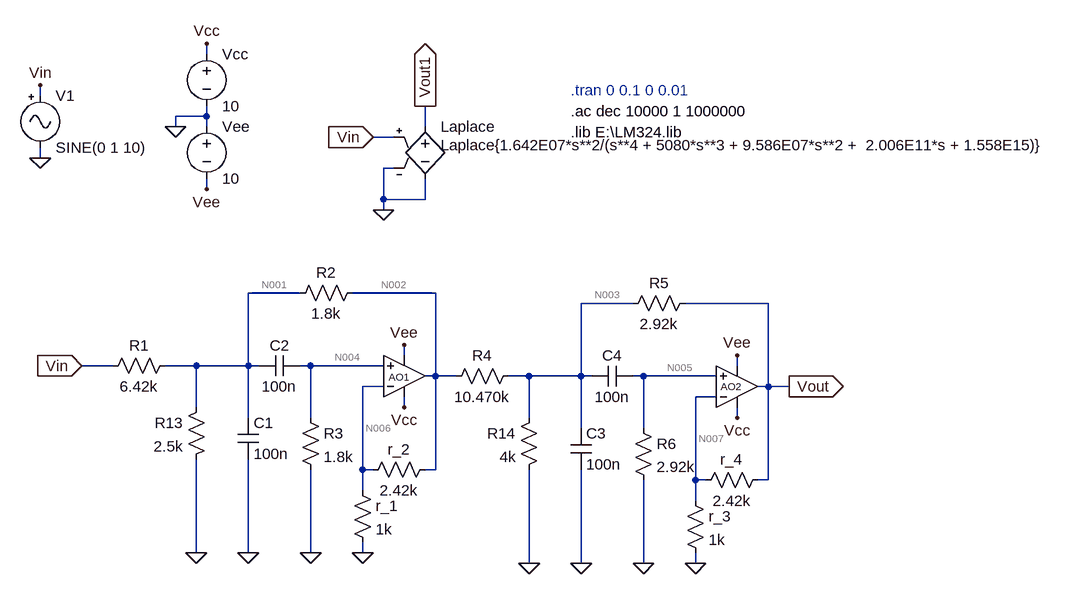
[diagram p0: schematic Filtro_Ajuste_Ganancia_2.asc]
Filtro_Ajuste_Ganancia_2.asc, the LTspice schematic file:
Version 4.1
SHEET 1 1376 980
WIRE -64 -416 -64 -432
WIRE -320 -352 -320 -368
WIRE -64 -320 -64 -336
WIRE -64 -320 -112 -320
WIRE -112 -304 -112 -320
WIRE -64 -304 -64 -320
WIRE 272 -304 272 -336
WIRE 224 -288 192 -288
WIRE -320 -256 -320 -272
WIRE 224 -240 208 -240
WIRE -64 -208 -64 -224
WIRE 208 -192 208 -240
WIRE 272 -192 272 -224
WIRE 272 -192 208 -192
WIRE 208 -176 208 -192
WIRE 80 -48 0 -48
WIRE 288 -48 160 -48
WIRE 592 -32 512 -32
WIRE 800 -32 672 -32
WIRE 240 48 240 32
WIRE -208 64 -256 64
WIRE -80 64 -128 64
WIRE 0 64 0 -48
WIRE 0 64 -80 64
WIRE 16 64 0 64
WIRE 96 64 80 64
WIRE 208 64 96 64
WIRE 752 64 752 48
WIRE 288 80 288 -48
WIRE 288 80 272 80
WIRE 320 80 288 80
WIRE 432 80 400 80
WIRE 512 80 512 -32
WIRE 512 80 432 80
WIRE 528 80 512 80
WIRE 608 80 592 80
WIRE 720 80 608 80
WIRE 208 96 176 96
WIRE 800 96 800 -32
WIRE 800 96 784 96
WIRE 832 96 800 96
WIRE 720 112 688 112
WIRE -80 128 -80 64
WIRE 240 128 240 112
WIRE 0 144 0 64
WIRE 96 144 96 64
WIRE 432 144 432 80
WIRE 752 144 752 128
WIRE 512 160 512 80
WIRE 608 160 608 80
WIRE 176 224 176 96
WIRE 192 224 176 224
WIRE 288 224 288 80
WIRE 288 224 272 224
WIRE 688 240 688 112
WIRE 704 240 688 240
WIRE 800 240 800 96
WIRE 800 240 784 240
WIRE 176 256 176 224
WIRE 688 272 688 240
WIRE -80 352 -80 208
WIRE 0 352 0 208
WIRE 96 352 96 224
WIRE 176 352 176 336
WIRE 432 368 432 224
WIRE 512 368 512 224
WIRE 608 368 608 240
WIRE 688 368 688 352
FLAG 240 128 Vcc
FLAG 240 32 Vee
FLAG -112 -304 0
FLAG -64 -432 Vcc
FLAG -64 -208 Vee
FLAG 176 352 0
FLAG 96 352 0
FLAG 0 352 0
FLAG 752 144 Vcc
FLAG 752 48 Vee
FLAG 688 368 0
FLAG 608 368 0
FLAG 512 368 0
FLAG -320 -368 Vin
FLAG -320 -256 0
FLAG 832 96 Vout
IOPIN 832 96 Out
FLAG 208 -176 0
FLAG 272 -336 Vout1
IOPIN 272 -336 Out
FLAG -256 64 Vin
IOPIN -256 64 In
FLAG 192 -288 Vin
IOPIN 192 -288 In
FLAG -80 352 0
FLAG 432 368 0
SYMBOL res -112 48 R90
WINDOW 0 0 56 VBottom 2
WINDOW 3 32 56 VTop 2
SYMATTR InstName R1
SYMATTR Value 6.42k
SYMBOL res 176 -64 R90
WINDOW 0 0 56 VBottom 2
WINDOW 3 32 56 VTop 2
SYMATTR InstName R2
SYMATTR Value 1.8k
SYMBOL cap -16 144 R0
SYMATTR InstName C1
SYMATTR Value 100n
SYMBOL cap 80 48 R90
WINDOW 0 0 32 VBottom 2
WINDOW 3 32 32 VTop 2
SYMATTR InstName C2
SYMATTR Value 100n
SYMBOL res 80 128 R0
SYMATTR InstName R3
SYMATTR Value 1.8k
SYMBOL res 288 208 R90
WINDOW 0 0 56 VBottom 2
WINDOW 3 32 56 VTop 2
SYMATTR InstName r_2
SYMATTR Value 2.42k
SYMBOL res 160 240 R0
SYMATTR InstName r_1
SYMATTR Value 1k
SYMBOL voltage -64 -432 R0
WINDOW 123 0 0 Left 0
WINDOW 39 0 0 Left 0
SYMATTR InstName Vcc
SYMATTR Value 10
SYMBOL voltage -64 -320 R0
WINDOW 123 0 0 Left 0
WINDOW 39 0 0 Left 0
SYMATTR InstName Vee
SYMATTR Value 10
SYMBOL res 416 64 R90
WINDOW 0 0 56 VBottom 2
WINDOW 3 32 56 VTop 2
SYMATTR InstName R4
SYMATTR Value 10.470k
SYMBOL res 688 -48 R90
WINDOW 0 0 56 VBottom 2
WINDOW 3 32 56 VTop 2
SYMATTR InstName R5
SYMATTR Value 2.92k
SYMBOL cap 496 160 R0
SYMATTR InstName C3
SYMATTR Value 100n
SYMBOL cap 592 64 R90
WINDOW 0 0 32 VBottom 2
WINDOW 3 32 32 VTop 2
SYMATTR InstName C4
SYMATTR Value 100n
SYMBOL res 592 144 R0
SYMATTR InstName R6
SYMATTR Value 2.92k
SYMBOL res 800 224 R90
WINDOW 0 0 56 VBottom 2
WINDOW 3 32 56 VTop 2
SYMATTR InstName r_4
SYMATTR Value 2.42k
SYMBOL res 672 256 R0
SYMATTR InstName r_3
SYMATTR Value 1k
SYMBOL Misc\\signal -320 -368 R0
WINDOW 39 0 0 Left 0
SYMATTR InstName V1
SYMATTR Value SINE(0 1 10)
SYMATTR Value2 AC 1
SYMBOL e 272 -320 R0
WINDOW 3 24 44 Left 2
SYMATTR Value Laplace{1.642E07*s**2/(s**4 + 5080*s**3 + 9.586E07*s**2 +  2.006E11*s + 1.558E15)}
SYMATTR InstName Laplace
SYMBOL OpAmps\\opamp2 240 144 M180
WINDOW 0 -24 63 Left 1
WINDOW 3 16 96 Invisible 2
SYMATTR InstName AO1
SYMATTR Value LM324
SYMBOL OpAmps\\opamp2 752 160 M180
WINDOW 0 -25 64 Left 1
WINDOW 3 16 96 Invisible 2
SYMATTR InstName AO2
SYMATTR Value LM324
SYMBOL res -64 112 M0
SYMATTR InstName R13
SYMATTR Value 2.5k
SYMBOL res 448 128 M0
SYMATTR InstName R14
SYMATTR Value 4k
TEXT 496 -360 Left 2 ;.tran 0 0.1 0 0.01
TEXT 496 -328 Left 2 !.ac dec 10000 1 1000000
TEXT 496 -296 Left 2 !.lib E:\\LM324.lib

The netlist it stands for:
* Filtro_Ajuste_Ganancia_2.asc
R1 N001 Vin 6.42k
R2 N002 N001 1.8k
C1 N001 0 100n
C2 N004 N001 100n
R3 N004 0 1.8k
r_2 N002 N006 2.42k
r_1 N006 0 1k
Vcc Vcc 0 10
Vee 0 Vee 10
R4 N003 N002 10.470k
R5 Vout N003 2.92k
C3 N003 0 100n
C4 N005 N003 100n
R6 N005 0 2.92k
r_4 Vout N007 2.42k
r_3 N007 0 1k
V1 Vin 0 SINE(0 1 10) AC 1
E§Laplace Vout1 0 Vin 0 Laplace{1.642E07*s**2/(s**4 + 5080*s**3 + 9.586E07*s**2 +  2.006E11*s + 1.558E15)}
X§AO1 N004 N006 Vcc Vee N002 LM324  ; pins In+ In- V+ V- OUT
X§AO2 N005 N007 Vcc Vee Vout LM324  ; pins In+ In- V+ V- OUT
R13 N001 0 2.5k
R14 N003 0 4k
* .tran 0 0.1 0 0.01
.ac dec 10000 1 1000000
.lib E:\LM324.lib
.backanno
.end

* Results of the author's LTspice run, read from the files saved beside the schematic
* Operating Point, zero values left out:
*   V(n004) = 35.86 µV
*   V(n006) = 2.203 µV
*   V(vee) = -10 V
*   V(n005) = 58.17 µV
*   V(n001) = -20.36 µV
*   V(n002) = -40.72 µV
*   V(vcc) = 10 V
*   V(n003) = 12.06 µV
*   V(vout) = 35.59 µV
*   V(n007) = 24.51 µV
*   I(R3) = 19.92 nA
*   I(Vcc) = -1.34 mA
*   I(R5) = 8.056 nA
*   I(R6) = 19.92 nA
*   I(R13) = -8.142 nA
*   I(R1) = -3.171 nA
*   I(r_2) = -17.74 nA
*   I(r_3) = 24.51 nA
*   I(R2) = -11.31 nA
*   I(r_1) = 2.203 nA
*   I(R4) = 5.041 nA
*   I(V1) = -3.171 nA
*   I(R14) = 3.015 nA
*   I(Vee) = -1.34 mA
*   I(r_4) = 4.575 nA
*   Ix(ao2:1) = -19.92 nA
*   Ix(ao2:2) = -19.94 nA
*   Ix(ao2:3) = 669.9 µA
*   Ix(ao2:4) = -669.8 µA
*   Ix(ao2:5) = -12.63 nA
*   Ix(ao1:1) = -19.92 nA
*   Ix(ao1:2) = -19.94 nA
*   Ix(ao1:3) = 669.9 µA
*   Ix(ao1:4) = -669.8 µA
*   Ix(ao1:5) = 34.09 nA